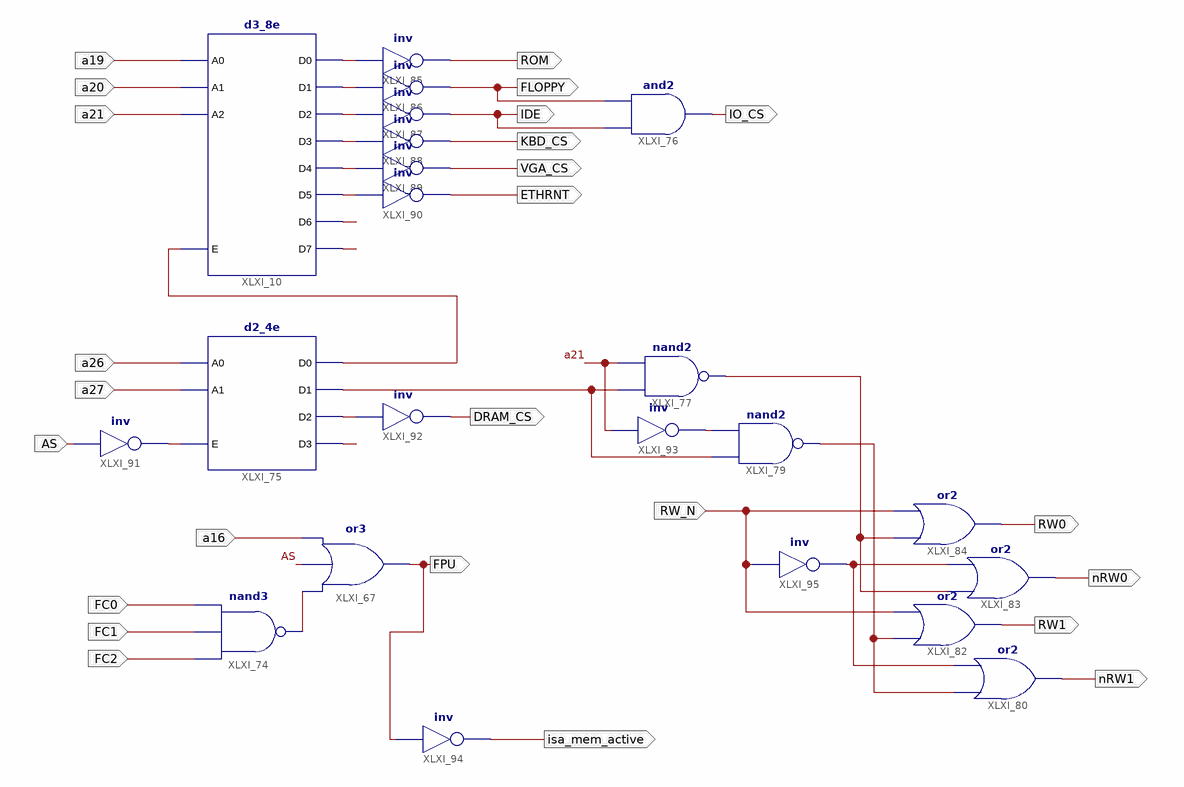
[diagram p0: schematic sheet 1]
// Xilinx ISE schematic schema.sch (xc9500xl) as structural Verilog: 22 symbols, 25 ports
module schema (
  input  AS,
  input  a19,
  input  a20,
  input  a21,
  input  a26,
  input  a27,
  input  RW_N,
  input  FC1,
  input  FC2,
  input  FC0,
  input  a16,
  output ROM,
  output FLOPPY,
  output IDE,
  output KBD_CS,
  output VGA_CS,
  output ETHRNT,
  output DRAM_CS,
  output RW0,
  output RW1,
  output nRW0,
  output nRW1,
  output IO_CS,
  output FPU,
  output isa_mem_active
);

  wire XLXN_140, XLXN_141, XLXN_142, XLXN_143, XLXN_144, XLXN_145, XLXN_146, XLXN_147, XLXN_174, XLXN_176,
       XLXN_177, XLXN_212, XLXN_232, XLXN_250, XLXN_254, XLXN_299, XLXN_309, XLXN_312;

  d3_8e #(.VhdlModel("INV"), .VeriModel("INV"), .Level("XILINX")) XLXI_10 (
    .A0(a19), .A1(a20), .A2(a21), .E(XLXN_174), .D0(XLXN_140), .D1(XLXN_141), .D2(XLXN_142), .D3(XLXN_143),
    .D4(XLXN_144), .D5(XLXN_145), .D6(XLXN_146), .D7(XLXN_147));
  or XLXI_67 (FPU, XLXN_299, AS, a16);
  nand XLXI_74 (XLXN_299, FC2, FC1, FC0);
  d2_4e #(.VhdlModel("INV"), .VeriModel("INV"), .Level("XILINX")) XLXI_75 (
    .A0(a26), .A1(a27), .E(XLXN_212), .D0(XLXN_174), .D1(XLXN_254), .D2(XLXN_176), .D3(XLXN_177));
  and XLXI_76 (IO_CS, IDE, FLOPPY);
  nand XLXI_77 (XLXN_312, XLXN_254, a21);
  nand XLXI_79 (XLXN_232, XLXN_254, XLXN_250);
  or XLXI_80 (nRW1, XLXN_232, XLXN_309);
  or XLXI_82 (RW1, XLXN_232, RW_N);
  or XLXI_83 (nRW0, XLXN_312, XLXN_309);
  or XLXI_84 (RW0, XLXN_312, RW_N);
  not XLXI_85 (ROM, XLXN_140);
  not XLXI_86 (FLOPPY, XLXN_141);
  not XLXI_87 (IDE, XLXN_142);
  not XLXI_88 (KBD_CS, XLXN_143);
  not XLXI_89 (VGA_CS, XLXN_144);
  not XLXI_90 (ETHRNT, XLXN_145);
  not XLXI_91 (XLXN_212, AS);
  not XLXI_92 (DRAM_CS, XLXN_176);
  not XLXI_93 (XLXN_250, a21);
  not XLXI_94 (isa_mem_active, FPU);
  not XLXI_95 (XLXN_309, RW_N);
endmodule
